# EasyEDA schematic SCH_modular-power_2024-03-29.json
TITLE: Rechargeable power supply; REV: 1.0; Date: 2024-01-11; Sheet: 1/1; Drawn By: msw; Company: Hack Club
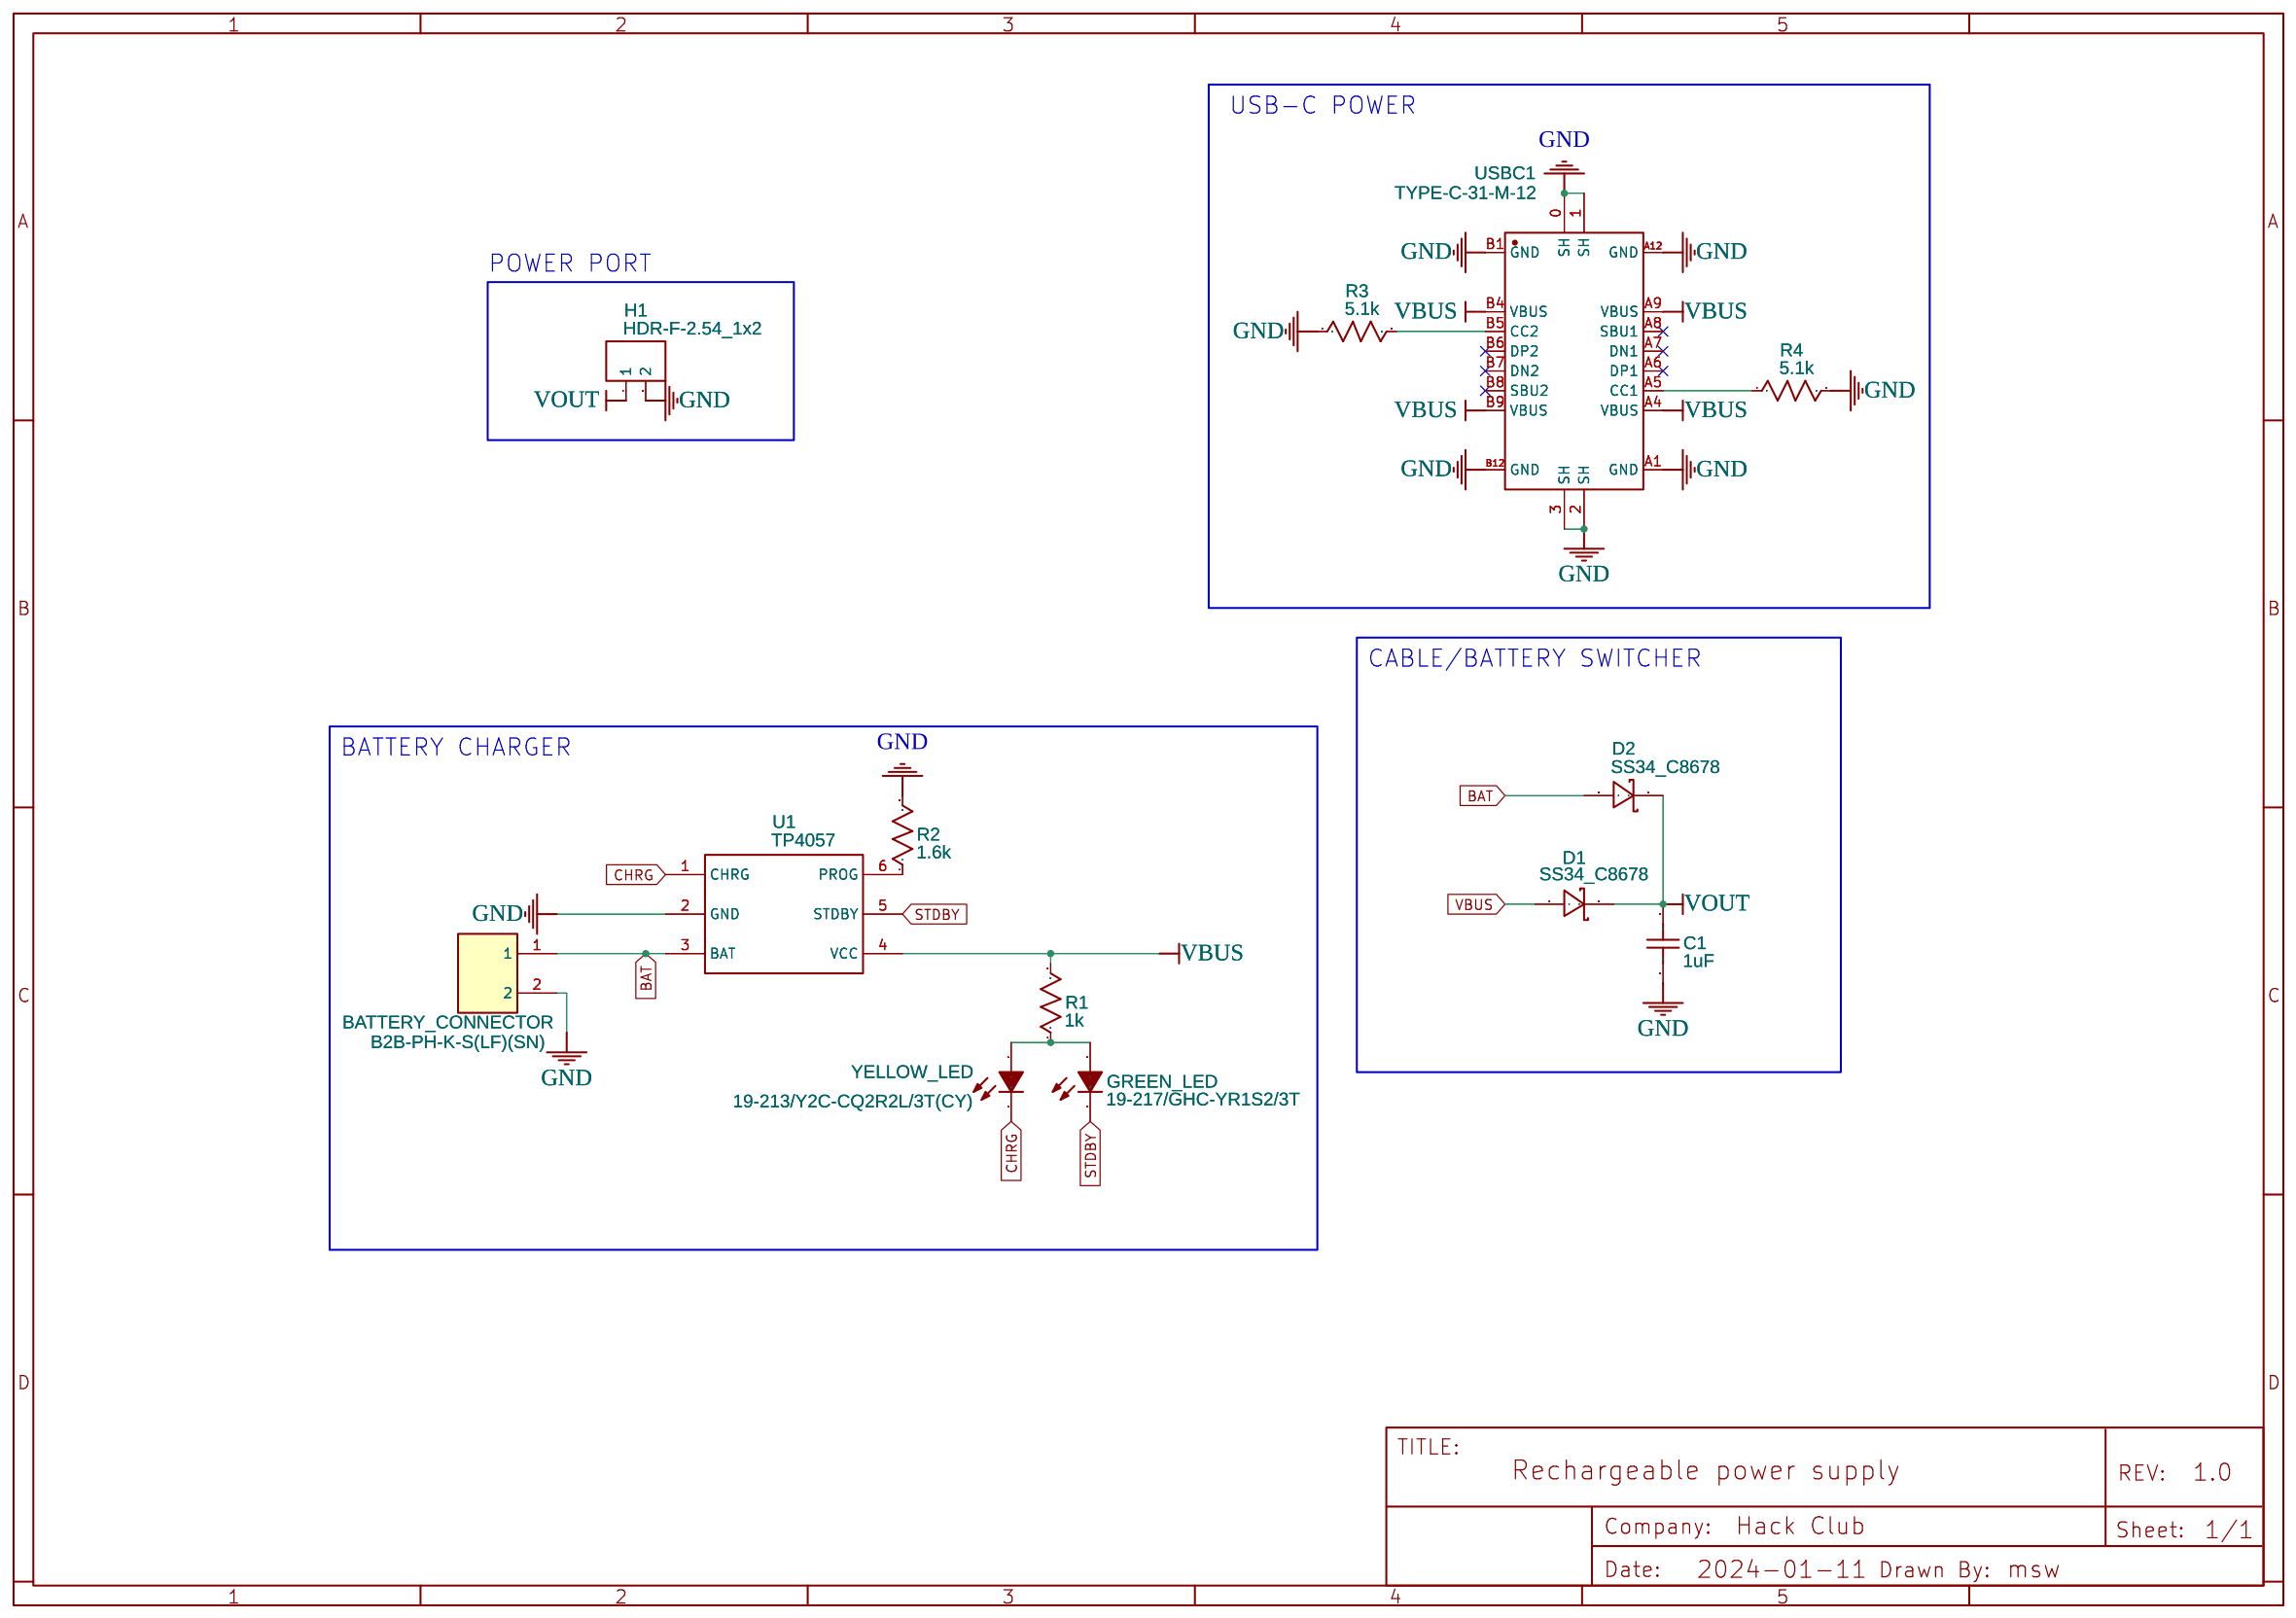
[diagram p0: schematic sheet]

## Parts
BATTERY_CONNECTOR  B2B-PH-K-S(LF)(SN)  [CONN-TH_B2B-PH-K-S]
C1  1uF  [C0603]
D1  SS34_C8678  [SMA_L4.3-W2.6-LS5.2-RD]
D2  SS34_C8678  [SMA_L4.3-W2.6-LS5.2-RD]
GREEN_LED  19-217/GHC-YR1S2/3T  [LED0603-RD]
H1  HDR-F-2.54_1x2  [HDR-F-2.54_1X2]
R1  1k  [R0603]
R2  1.6k  [R0603]
R3  5.1k  [R0603]
R4  5.1k  [R0603]
U1  TP4057  [SOT-23-6_L2.9-W1.6-P0.95-LS2.8-BL]
USBC1  TYPE-C-31-M-12  [USB-C_SMD-TYPE-C-31-M-12]
YELLOW_LED  19-213/Y2C-CQ2R2L/3T(CY)  [LED0603-RD-YELLOW]

## Library data of the parts
BATTERY_CONNECTOR = B2B-PH-K-S(LF)(SN): Contributor: LCSC; Supplier: LCSC; Manufacturer: JST; Supplier Part: C131337; JLCPCB Part Class: Extended Part
C1 = C_0603_US: Contributor: LCEDA_Lib
D1 D2 = SS34_C8678: Supplier: LCSC; Manufacturer Part: SS34; Manufacturer: MDD; Supplier Part: C8678; JLCPCB Part Class: Basic Part
GREEN_LED = 19-217/GHC-YR1S2/3T: Supplier: LCSC; Manufacturer: EVERLIGHT(亿光); Supplier Part: C72043; JLCPCB Part Class: Basic Part
H1 = HDR-F-2.54_1x2: Supplier Part: C49661; Supplier: LCSC; Contributor: LCEDA_Lib
R1-R4 = R_0201_US: Contributor: LCEDA_Lib
U1 = TP4057: Supplier: LCSC; Manufacturer: TOPPOWER(南京拓微); Manufacturer Part: TP4057-42-SOT26-R; Supplier Part: C12044; JLCPCB Part Class: Basic Part
USBC1 = TYPE-C-31-M-12: Contributor: LCSC; Supplier: LCSC; Supplier Part: C165948; Manufacturer: 韩国韩荣; JLCPCB Part Class: Extended Part
YELLOW_LED = 19-213/Y2C-CQ2R2L/3T(CY): Supplier: LCSC; Manufacturer: EVERLIGHT(亿光); Supplier Part: C72038; JLCPCB Part Class: Basic Part

## Nets
GND: BATTERY_CONNECTOR.2 C1.1 H1.2 R2.2 R3.1 R4.2 U1.2(GND) USBC1.0(SH) USBC1.1(SH) USBC1.2(SH) USBC1.3(SH) USBC1.A1(GND) USBC1.A12(GND) USBC1.B1(GND) USBC1.B12(GND)
VBUS: D1.2(A) R1.2 U1.4(VCC) USBC1.A4(VBUS) USBC1.A9(VBUS) USBC1.B4(VBUS) USBC1.B9(VBUS)
BAT: BATTERY_CONNECTOR.1 D2.2(A) U1.3(BAT)
CHRG: U1.1(CHRG) YELLOW_LED.1(C)
STDBY: GREEN_LED.1(C) U1.5(STDBY)
VOUT: C1.2 D1.1(K) D2.1(K) H1.1
Net-(GREEN_LED-2): GREEN_LED.2(A) R1.1 YELLOW_LED.2(A)
Net-(R2-1): R2.1 U1.6(PROG)
Net-(R3-2): R3.2 USBC1.B5(CC2)
Net-(R4-1): R4.1 USBC1.A5(CC1)

Not connected (* = marked no-connect by the designer): USBC1 A6(DP1)* A7(DN1)* A8(SBU1)* B6(DP2)* B7(DN2)* B8(SBU2)*

## Notes on the sheet
- USB-C POWER
- POWER PORT
- CABLE/BATTERY SWITCHER
- BATTERY CHARGER
